# Altium schematic sheet stm32b.SchDoc
size A3
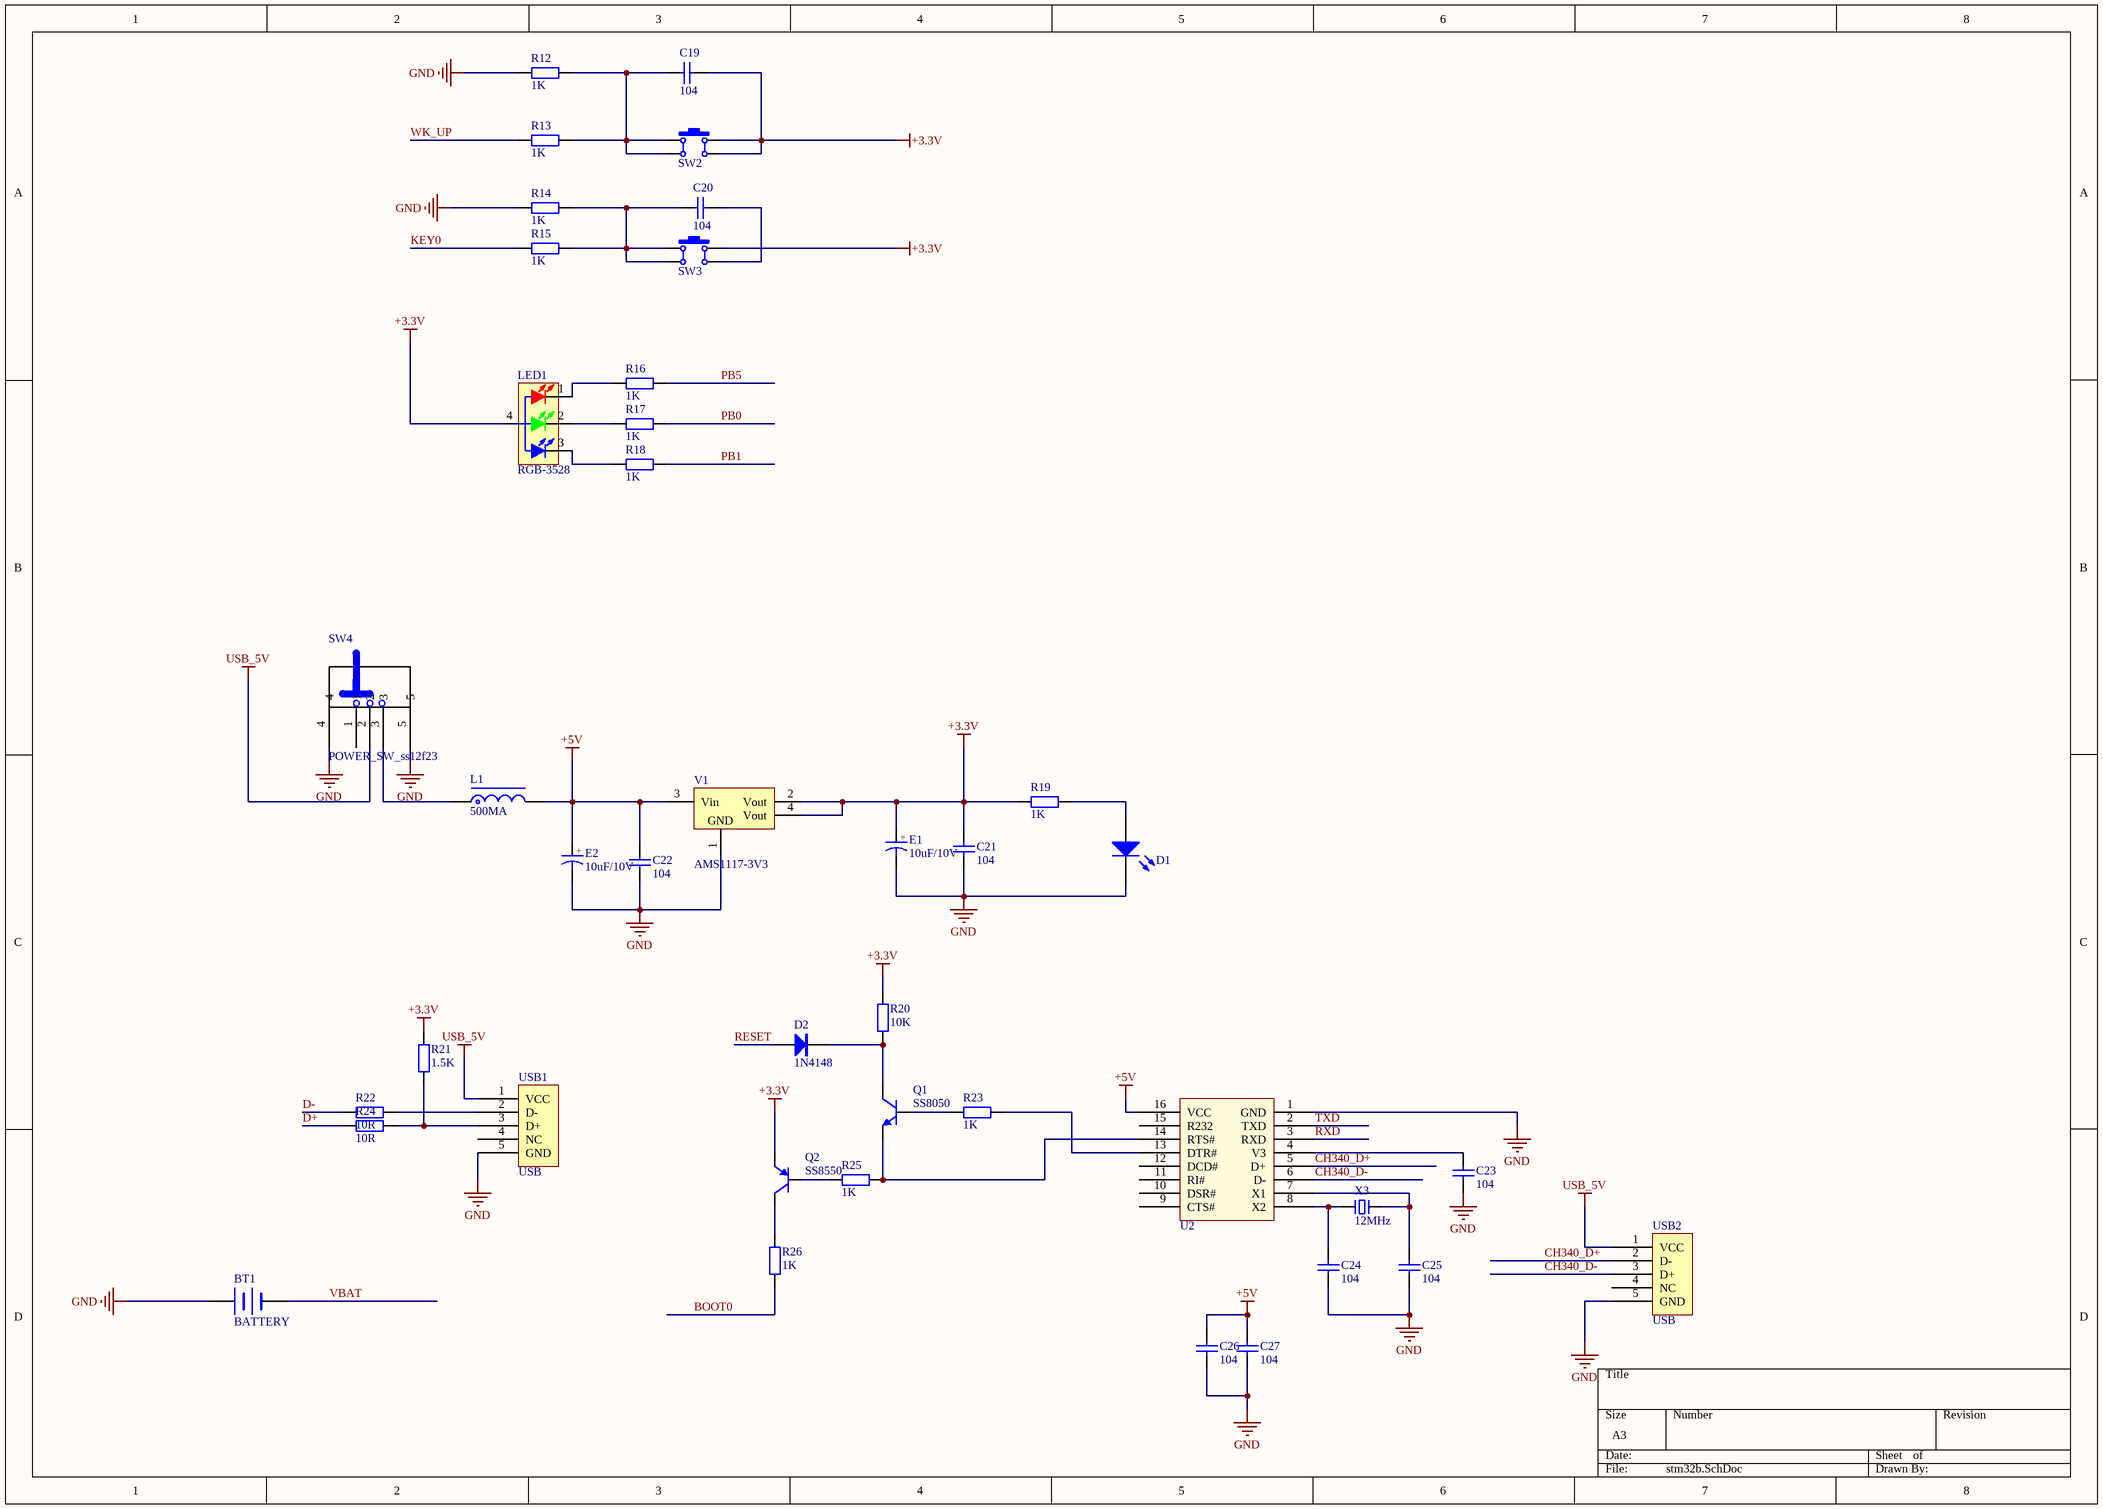
[diagram p0: stm32b.SchDoc]

## Parts
BT1  BATTERY  [CR1220-2 电池卧式底座]
C19  104  [1210]
C20  104  [1210]
C21  104  [1210]
C22  104  [1210]
C23  104  [1210]
C24  104  [1210]
C25  104  [1210]
C26  104  [1210]
C27  104  [1210]
D1  LED  [0805]  (value not drawn)
D2  1N4148  [DO-204AH(DO-35)]
E1  10uF/10V  [C65225]
E2  10uF/10V  [C65225]
L1  500MA  [0805]
LED1  RGB-3528  [led3色]
Q1  SS8050  [SOT-23]
Q2  SS8550  [SOT-23]
R12  1K  [R1206-HP_L]
R13  1K  [R1206-HP_L]
R14  1K  [R1206-HP_L]
R15  1K  [R1206-HP_L]
R16  1K  [R1206-HP_L]
R17  1K  [R1206-HP_L]
R18  1K  [R1206-HP_L]
R19  1K  [R1206-HP_L]
R20  10K  [R1206-HP_L]
R21  1.5K  [R1206-HP_L]
R22  10R  [R1206-HP_L]
R23  1K  [R1206-HP_L]
R24  10R  [R1206-HP_L]
R25  1K  [R1206-HP_L]
R26  1K  [R1206-HP_L]
SW2  4x4x1.5  [按键]  (value not drawn)
SW3  4x4x1.5  [按键]  (value not drawn)
SW4  POWER_SW_ss12f23  [SS-12F23]
U2  CH340G  [SOP16]  (value not drawn)
USB1  USB  [MICRO USB 5S B 型]
USB2  USB  [MICRO USB 5S B 型]
V1  AMS1117-3V3  [AMS1117-3.3]
X3  12MHz  [HC-49S]

## Nets
+3.3V: C19.2 C21.2 E1.1 LED1.4(A) Q2.2(E) R19.2 R20.1 R21.2 SW2.2 SW2.3 SW3.2 V1.2(Vout) V1.4(Vout)
+5V: C22.2 C26.2 C27.2 E2.1 L1.2 U2.16(VCC) V1.3(Vin)
GND: BT1.1(+) C21.1 C22.1 C23.1 C24.2 C25.1 C26.1 C27.1 D1.2(K) E1.2 E2.2 R12.2 R14.2 SW4.4 SW4.5 U2.1(GND) USB1.5(GND) USB2.5(GND) V1.1(GND)
USB_5V: SW4.2 USB1.1(VCC) USB2.1(VCC)
BOOT0: R26.1
CH340_D+: U2.5(D+) USB2.2(D-)
CH340_D-: U2.6(D-) USB2.3(D+)
D+: R24.2
D-: R22.2
KEY0: R15.2
PB0: R17.1
PB1: R18.1
PB5: R16.1
RESET: D2.1(A)
RXD: U2.3(RXD)
TXD: U2.2(TXD)
VBAT: BT1.2(-)
WK_UP: R13.2
NetC19_1: C19.1 R12.1 R13.1 SW2.1 SW2.4
NetC20_1: C20.1 R14.1 R15.1 SW3.1 SW3.4
NetC20_2: C20.2 SW3.3
NetC23_2: C23.2 U2.4(V3)
NetC24_1: C24.1 U2.8(X2) X3.2
NetC25_2: C25.2 U2.7(X1) X3.1
NetD1_1: D1.1(A) R19.1
NetD2_2: D2.2(K) Q1.3(C) R20.2
NetL1_1: L1.1 SW4.3
NetLED1_1: LED1.1(RED_K) R16.2
NetLED1_2: LED1.2(GREEN_K) R17.2
NetLED1_3: LED1.3(BULE_K) R18.2
NetQ1_1: Q1.1(B) R23.1
NetQ1_2: Q1.2(E) R25.2 U2.14(RTS#)
NetQ2_1: Q2.1(B) R25.1
NetQ2_3: Q2.3(C) R26.2
NetR21_1: R21.1 R24.1 USB1.3(D+)
NetR22_1: R22.1 USB1.2(D-)
NetR23_2: R23.2 U2.13(DTR#)

Not connected (* = marked no-connect by the designer): SW4 1; U2 9(CTS#) 10(DSR#) 11(RI#) 12(DCD#) 15(R232); USB1 4(NC); USB2 4(NC)

## Notes on the sheet
- (in symbol CE_SMD) +

## Library data of the parts
C19-C27 = C: 贴片电容; BOM名称: 无极性贴片电容; 联系卖家，免费查找封装: 唯一出售店铺网址https://shop463601444.taobao.com; 封装库来自淘宝卖家ID：黄晶宝石: 其他店铺购入均为盗版假冒封装库，请立即申请退款
D1 = LED: 发光二极管; 封装库来自淘宝卖家 ID：黄晶宝石: 其他店铺购入均为假冒，请立即申请退款，本店奖励现金5~20元
D2 = 1N4148: 开关二极管; BOM名称: 高速开关二极管; 联系卖家，免费查找封装: 唯一出售店铺网址https://shop463601444.taobao.com
E1 E2 = CE_SMD: 贴片电解电容; 联系卖家，免费查找封装: 唯一出售店铺网址https://shop463601444.taobao.com; 封装库来自淘宝卖家ID：黄晶宝石: 其他店铺购入均为盗版假冒封装库，请立即申请退款; BOM名称: 贴片电解电容
L1 = L-Molding Choke: 一体成型电感; 联系卖家，免费查找封装: 唯一出售店铺网址https://shop463601444.taobao.com; 封装库来自淘宝卖家ID：黄晶宝石: 其他店铺购入均为盗版假冒封装库，请立即申请退款; BOM名称: 一体成型电感
LED1 = LED-RGB 3528: 3528三基色LED; BOM名称: 三基色LED; 封装库来自淘宝卖家 ID：黄晶宝石: 其他店铺购入均为盗版，不享受售后技术支持服务，请立即申请退款
Q1 = 8050-SMD: 高频放大-NPN型; 联系卖家，免费查找封装: 唯一出售店铺网址https://shop463601444.taobao.com; 封装库来自淘宝卖家 ID：黄晶宝石: 其他店铺购入均为盗版，不享受售后技术支持服务，请立即申请退款; 参数: 40V 1.5A 1W 100MHZ; BOM名称: 高频放大-NPN型
Q2 = 8550-SMD: 高频放大-PNP型; 联系卖家，免费查找封装: 唯一出售店铺网址https://shop463601444.taobao.com; 封装库来自淘宝卖家 ID：黄晶宝石: 其他店铺购入均为盗版，不享受售后技术支持服务，请立即申请退款; 参数: 40V 1.5A 1W 100MHZ; BOM名称: 高频放大-PNP型
R12-R26 = R: 贴片电阻; 联系卖家，免费查找封装: 唯一出售店铺网址https://shop463601444.taobao.com; 封装库来自淘宝卖家ID：黄晶宝石: 其他店铺购入均为盗版假冒封装库，请立即申请退款; BOM名称: 贴片电阻
SW2 SW3 = TSW SMD-4x4: 贴片4x4轻触开关; 联系卖家，免费查找封装: 唯一出售店铺网址https://shop463601444.taobao.com; BOM名称: 贴片4x4轻触开关
V1 = AMS1117: 三端稳压芯片; BOM名称: 稳压芯片; 封装库来自淘宝卖家 ID：黄晶宝石: 其他店铺购入均为盗版，请立即申请退款，本店现金奖励5~20元; 联系卖家 免费查找封装: 唯一出售店铺网址https://shop463601444.taobao.com
X3 = XTAL-2P: 2脚无源脚晶振; 联系卖家，免费查找封装: 唯一出售店铺网址https://shop463601444.taobao.com; BOM名称: 2脚无源脚晶振